# Altium schematic sheet input.SchDoc
size A4; SheetNumber: 2; SheetTotal: 4
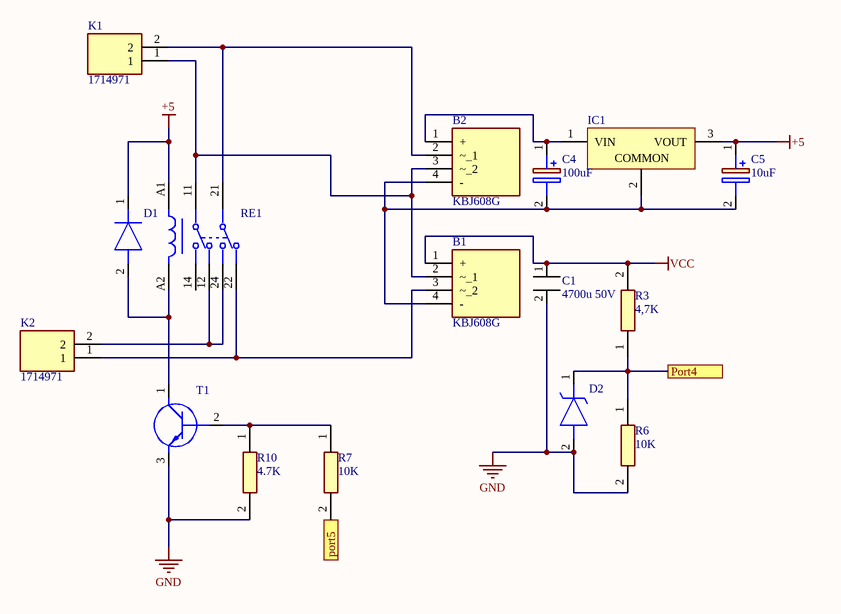
[diagram p0: input.SchDoc]

## Parts
B1  KBJ608G  [TO750P480X2500X1900-4P]
B2  KBJ608G  [TO750P480X2500X1900-4P]
C1  4700u 50V  [CAPPRD1000W80D2200H3700]
C4  100uF  [CAPAE1050X1050N]
C5  10uF  [RCE7U2J103J3K1H03B]
D1  1N4007  [DIOAD1408W86L464D236]  (value not drawn)
D2  TZMC5V1-GS08  [TZMC5V1GS08]  (value not drawn)
IC1  OKI-78SR-5/1.5-W36-C  [MURA-OKI-78SR-3]  (value not drawn)
K1  1714971  [1714971]
K2  1714971  [1714971]
R3  4,7K  [FP-CRCW0805-e3-IPC_A]
R6  10K  [FP-CRCW0805-e3-IPC_A]
R7  10K  [FP-CRCW0805-e3-IPC_A]
R10  4.7K  [FP-CRCW0805-e3-IPC_A]
RE1  RT424005F  [FP-RT424005F-MFG]  (value not drawn)
T1  BC547CBU  [BC547CBU]  (value not drawn)

## Ports
Port4, port5

## Nets
+5: C5.1(+) D1.1(K) IC1.3(VOUT) RE1.A1
GND: C1.2(-) D2.2(A) R6.2 R10.2 T1.3(E)
VCC: B1.1(+) C1.1(+) R3.2
Port4: D2.1(K) R3.1 R6.1 ; port Port4
port5: R7.2 ; port port5
NetB1_2: B1.2(~_1) B2.3(~_2) K1.1 RE1.11
NetB1_3: B1.3(~_2) K2.1 RE1.22
NetB1_4: B1.4(-) B2.4(-) C4.2(-) C5.2(-) IC1.2(COMMON)
NetB2_1: B2.1(+) C4.1(+) IC1.1(VIN)
NetB2_2: B2.2(~_1) K1.2 RE1.21
NetD1_2: D1.2(A) RE1.A2 T1.1(C)
NetK2_2: K2.2 RE1.12 RE1.24
NetR7_1: R7.1 R10.1 T1.2(B)

Not connected (* = marked no-connect by the designer): RE1 14

## Library data of the parts
B1 B2 = KBJ608G: Bridge Rectifier; Manufacturer_Name: Diodes Inc.; Datasheet Link: https://componentsearchengine.com//KBJ608G.pdf; Height: 4.8mm; Mouser2 Part Number: 621-KBJ608G; Mouser2 Price/Stock: https://www.mouser.com/Search/Refine.aspx?Keyword=621-KBJ608G; Manufacturer_Part_Number: KBJ608G
C1 C4 = MAL215097101E3: Capacitor Polarised; Manufacturer_Name: Vishay; Datasheet Link: https://componentsearchengine.com/Datasheets/2/MAL215097101E3.pdf; Height: 10.5mm; Manufacturer_Part_Number: MAL215097101E3
C5 = Component_1
D1 = 1N4007-T: Diode; Manufacturer_Name: Rectron; Datasheet Link: https://componentsearchengine.com//1N4007-T.pdf; Mouser2 Part Number: 583-1N4007-T; Mouser2 Price/Stock: https://www.mouser.com/Search/Refine.aspx?Keyword=583-1N4007-T; Manufacturer_Part_Number: 1N4007-T
D2 = TZMC5V1-GS08: Zener Diode; Manufacturer_Name: Vishay; Datasheet Link: https://componentsearchengine.com/Datasheets/2/TZMC5V1-GS08.pdf; Height: 1.6mm; Manufacturer_Part_Number: TZMC5V1-GS08
IC1 = CMP-2000-05274-1: Non-Isolated DC/DC Converter, 7.5 W, 7 to 36 V, 1.5 A, -40 to 85 degC, 3-Pin THD, RoHS; Manufacturer: Murata; Current - Output (Max): 1.5A; Power (Watts) - Max: 8W; Efficiency: 90.5%; Voltage - Input (Min): 7V; Voltage - Input (Max): 36V; Voltage - Output 1: 5V; Number of Outputs: 1; Package / Case: 3-SIPModule; Features: SCP; Type: LinearRegulatorReplacement; Size / Dimension: 0.41"Lx0.30"Wx0.65"H(10.4mmx7.6mmx16.5mm); Datasheet URL: https://datasheet.ciiva.com/8006/1790439-8006672.pdf; Datasheet Version: Oct-13; Power (Watts) - Manufacture Series: 8W; Voltage - Output 2: -; Series: Okami™OKI-78SR; Family: DCDCConverters; Manufacturer URL: http://www.murata.com/; Category: PowerSupplies-BoardMount; Voltage - Isolation: -; Packaging: Tube; Applications: ITE(Commercial); Mounting Type: ThroughHole; Voltage - Output 3: -; Operating Temperature: -40degC~85degC
K1 K2 = 1714971: Connector; Manufacturer_Name: Phoenix Contact; Datasheet Link: https://componentsearchengine.com/Datasheets/2/1714971.pdf; Height: 21.7mm; Manufacturer_Part_Number: 1714971
R3 R6 R7 R10 = CHP0805AFX-1000ELF: Resistor; Manufacturer_Name: Bourns; Datasheet Link: https://www.mouser.cn/datasheet/2/54/chp-a-1858677.pdf; Height: 0.6mm; Manufacturer_Part_Number: CHP0805AFX-1000ELF
RE1 = CMP-03395-000296-1: RELAY GENERAL PURPOSE DPDT 8A 5V; Power Consumption: 400mW; Coil Current: 80.6mA; Max Voltage Rating (AC): 400V; Coil Power: 500mW; Dropout Voltage: 500mV; Operate Time: 7ms; Contact Voltage Rating (AC): 250V; Coil Type: Non-Latching; Coil Resistance: 62R; Release Time: 3ms; Max Operating Temperature: 85°C; Package Quantity: 5000; Relay Type: General Purpose; Series: RT2; Lead Free: Lead Free; Coil Voltage (DC): 5V; Contact Current Rating: 8A; Packaging: Carton; Height: 15.7mm; Mount: Through Hole; Width: 12.7mm; ELV: Compliant; Termination: PCB; Contact Material: Silver; Throw Configuration: DPDT; Min Operating Temperature: -40°C; Weight: 13g; RoHS Compliant: Yes; Length: 29mm; Radiation Hardening: No
T1 = BC547CBU: Transistor BJT NPN; Manufacturer_Name: ON Semiconductor; Datasheet Link: https://www.onsemi.com/pdf/datasheet/bc550-d.pdf; Height: 5.33mm; Manufacturer_Part_Number: BC547CBU